# Altium project maysay.PrjPcb
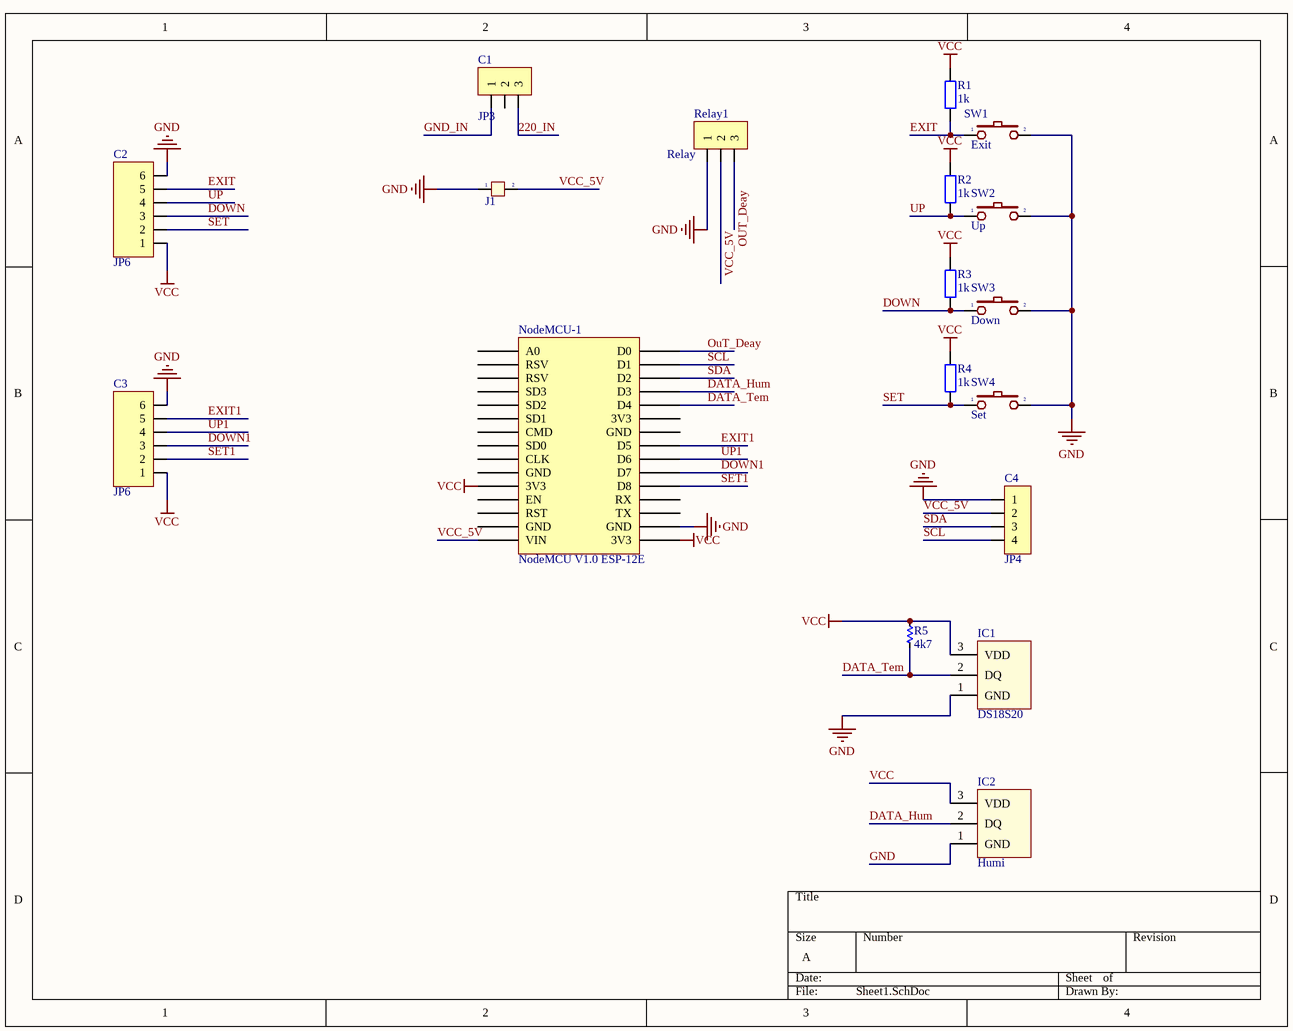
[diagram p0: Sheet1.SchDoc]
1 sheet, 18 parts. Net scope: global (net labels, ports and power ports of the same name join across sheets).
Board file: PCB1.PcbDoc

## Sheet Sheet1.SchDoc
size A

### Parts
C1  JP3  [JP3-C1T]
C2  JP6  [JP6-C1T]
C3  JP6  [JP6-C1T]
C4  JP4  [JP4-C1T]
IC1  DS18S20  [JP3-C1T]
IC2  Humi  [JP3-C1T]
J1  Jumper 2  [jp2h]  (value not drawn)
NodeMCU-1  NodeMCU V1.0 ESP-12E  [NodeMCU V1.0 ESP-12E]
R1  1k  [R1/2W]
R2  1k  [R1/2W]
R3  1k  [R1/2W]
R4  1k  [R1/2W]
R5  4k7  [RES-1/4W]
Relay1  Relay  [JP3-C1T]
SW1  Exit  [SW2]
SW2  Up  [SW2]
SW3  Down  [SW2]
SW4  Set  [SW2]

### Nets
GND: C2.6 C3.6 C4.1 IC1.1(GND) IC2.1(GND) J1.1 NodeMCU-1.GND Relay1.1 SW1.2 SW2.2 SW3.2 SW4.2
VCC: C2.1 C3.1 IC1.3(VDD) IC2.3(VDD) NodeMCU-1.3V3 R1.2 R2.2 R3.2 R4.2 R5.1
220_IN: C1.3
DATA_Hum: IC2.2(DQ) NodeMCU-1.D3
DATA_Tem: IC1.2(DQ) NodeMCU-1.D4 R5.2
DOWN: C2.3 R3.1 SW3.1
DOWN1: C3.3 NodeMCU-1.D7
EXIT: C2.5 R1.1 SW1.1
EXIT1: C3.5 NodeMCU-1.D5
GND_IN: C1.1
OUT_Deay: NodeMCU-1.D0 Relay1.3
SCL: C4.4 NodeMCU-1.D1
SDA: C4.3 NodeMCU-1.D2
SET: C2.2 R4.1 SW4.1
SET1: C3.2 NodeMCU-1.D8
UP: C2.4 R2.1 SW2.1
UP1: C3.4 NodeMCU-1.D6
VCC_5V: C4.2 J1.2 NodeMCU-1.VIN Relay1.2

Not connected (* = marked no-connect by the designer): C1 2; NodeMCU-1 A0 CLK CMD EN RST RSV RX SD0 SD1 SD2 SD3 TX

### Library data of the parts
C1 Relay1 = JP3: WR-PHD 2.54 mm Angled Socket Header; Manufacturer: W¨¹rth Elektronik eiSos GmbH; partNo: 613003143121; ComponentLink1 Description: Manufacturer; ComponentLink2 Description: Datasheet; NoPins: 03; Created Date: 29 March 2013; ComponentLink1URL: http://www.we-online.com; ComponentLink2URL: http://katalog.we-online.de/em/datasheet/6130xx143121.pdf; Created by: Karrer Zheng
C2 C3 = JP6: WR-PHD 2.54 mm Angled Socket Header; Manufacturer: W¨¹rth Elektronik eiSos GmbH; partNo: 613006143121; ComponentLink1 Description: Manufacturer; ComponentLink2 Description: Datasheet; NoPins: 06; Created Date: 29 March 2013; ComponentLink1URL: http://www.we-online.com; ComponentLink2URL: http://katalog.we-online.de/em/datasheet/6130xx143121.pdf; Created by: Karrer Zheng
C4 = JP4: WR-PHD 2.54 mm Angled Socket Header; Manufacturer: W¨¹rth Elektronik eiSos GmbH; partNo: 613004143121; ComponentLink1 Description: Manufacturer; ComponentLink2 Description: Datasheet; NoPins: 04; Created Date: 29 March 2013; ComponentLink1URL: http://www.we-online.com; ComponentLink2URL: http://katalog.we-online.de/em/datasheet/6130xx143121.pdf; Created by: Karrer Zheng
IC1 IC2 = DS18S20: High Precision  1-Wire® Digital Thermometer
J1 = JP 2: Value: JP 2
NodeMCU-1 = NodeMCU V1.0 ESP-12E: NodeMCU V1.0 ESP8266 (ESP-12E)
R1-R4 = R1/4W: Resistor 1/4W; Value: R1/4W - 1K
R5 = Res: Manufacturer: Generic Components; Class: Passive; SubClass: R; Published: 08/06/2000; Publisher: Altium Hobart Technology Centre
SW1-SW4 = SW2: Switch button 2 pin; Value: SW chip 2 pin